# EAGLE design LED (EAGLE 7.6.0)
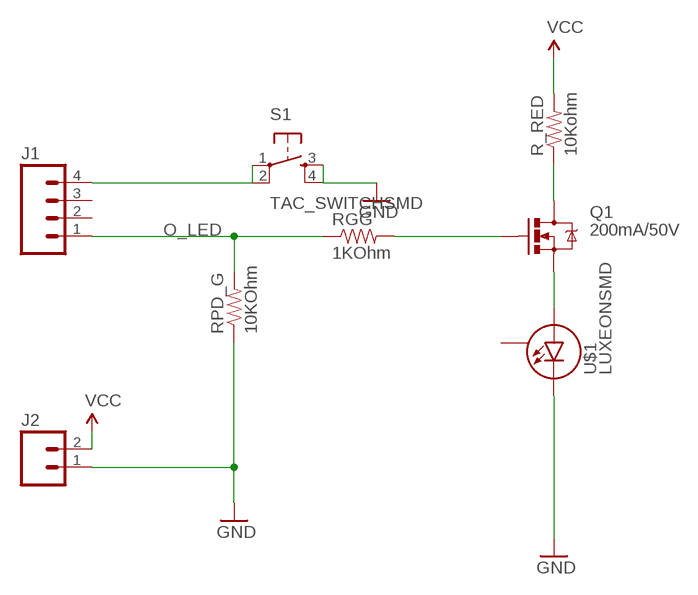
[diagram p0: schematic, sheet 1]

## Parts
J1  M04NO_SILK_ALL_ROUND  [1X04_NO_SILK_ALL_ROUND]
J2  M021X02_NO_SILK  [1X02_NO_SILK]
Q1  200mA/50V  MOSFET-NCHANNELBSS138  [SOT23-3]
R_RED  10Kohm  RESISTOR0805-RES  [0805]
RGG  1KOhm  RESISTOR0805-RES  [0805]
RPD_G  10KOhm  RESISTOR0805-RES  [0805]
S1  TAC_SWITCHSMD  [TACTILE-SWITCH-SMD]
U$1  LUXEONSMD  [LUXEON]

## Nets
GND: J2.1 S1.3 S1.4 U$1.C
N$1: Q1.1(G) RGG.2
N$2 [SUPPLY]: Q1.3(D) R_RED.1
N$3 [SUPPLY]: Q1.2(S) U$1.A
N$4: J1.4 S1.1 S1.2
O_LED: J1.1 RGG.1 RPD_G.2
VCC [SUPPLY]: J2.2 R_RED.2
Unconnected: J1.2 J1.3 RPD_G.1 U$1.S

## Library data of the parts
J1 = SparkFun-Connectors:M04: Header 4 Standard 4-pin 0.1" header. Use with straight break away headers (SKU : PRT-00116), right angle break away headers (PRT-00553), swiss pins (PRT-00743), machine pins (PRT-00117), and female headers (PRT-00115). Molex polarized connector foot print use with SKU : PRT-08231 with associated crimp pins and housings. 1MM SMD Version SKU: PRT-10208; PROD_ID: CONN-09696
J2 = SparkFun-Connectors:M02: Standard 2-pin 0.1" header. Use with - straight break away headers ( PRT-00116) - right angle break away headers (PRT-00553) - swiss pins (PRT-00743) - machine pins (PRT-00117) - female headers (PRT-00115) Molex polarized connector foot print use with: PRT-08233 with associated crimp pins and housings. 2.54_SCREWTERM for use with PRT-10571. 3.5mm Screw Terminal footprints for PRT-08084 5mm Screw Terminal footprints for use with PRT-08432
Q1 = SparkFun-DiscreteSemi:MOSFET-NCHANNEL: Common NMOSFET Parts MFG P/N Store ID Prod ID FDD8780 TRANS-09984 SI7820DN TRANS-11055 FDS6630A IC-08089 2N7002PW TRANS-11151 FQP30N06L COM-10213 TRANS-10060 BSS123LT1G TRANS-08345 BSS138 TRANS-00830 BS170 2N7000; PROD_ID: TRANS-00830
R_RED RGG RPD_G = SparkFun-Resistors:RESISTOR: Resistor Basic schematic elements and footprints for 0603, 1206, and PTH resistors.
S1 = SparkFun-Retired:TAC_SWITCH: Momentary Switch Button commonly used for reset or general input. Spark Fun Electronics SKU : COM-00097 SMT- SWCH-08247; PROD_ID: SWCH-08247
U$1 = SparkFun-LED:LUXEON: Luxeon LED This footprint works with the current 1 Watt, 3 Watt, and 5 Watt LEDs. These blindingly bright LEDs generate a lot of heat so the footprint has a large pad under the LED for thermal transfer. Schematic and footprint are proven. Spark Fun Electronics SKU : COM-00603

## Net classes
0 default: width 0.3 mm
1 GND: width 0.5 mm, clearance 0.5 mm
2 SUPPLY: width 0.5 mm, clearance 0.003 mm

## Board
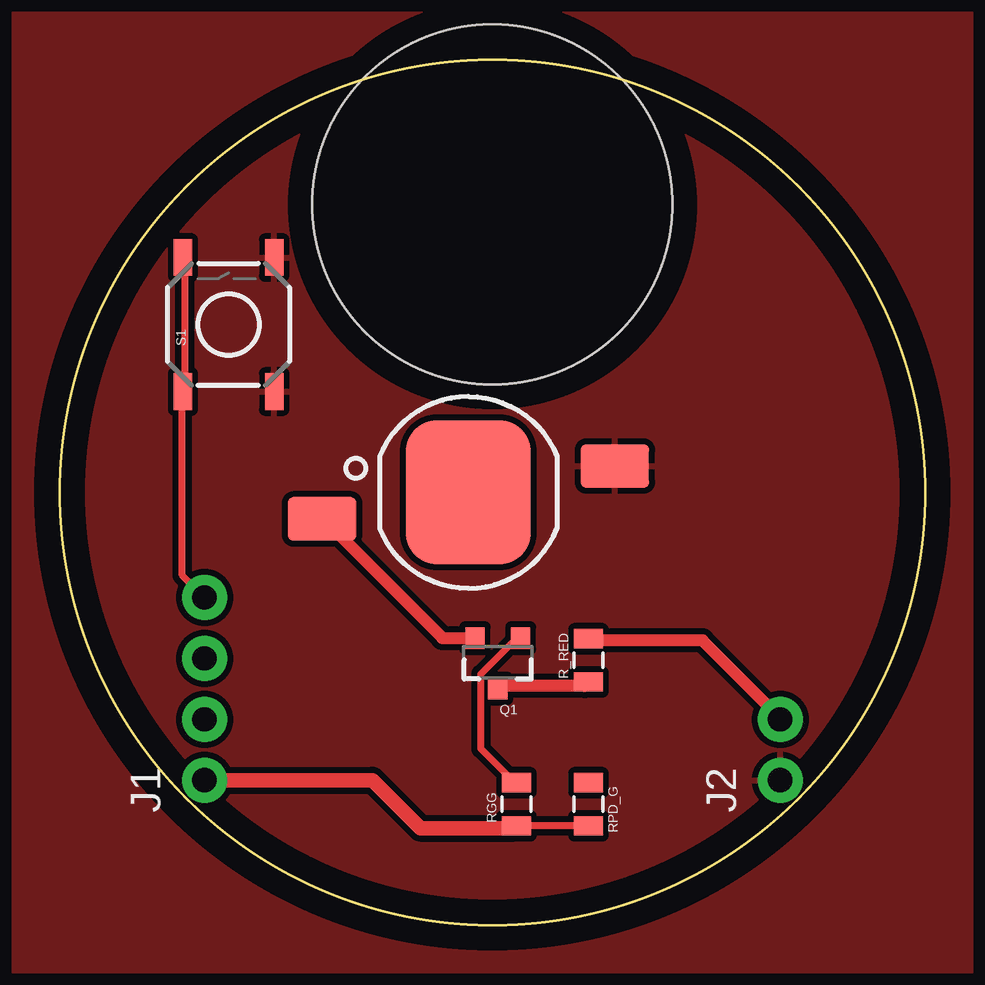
[diagram p1: board, top side]
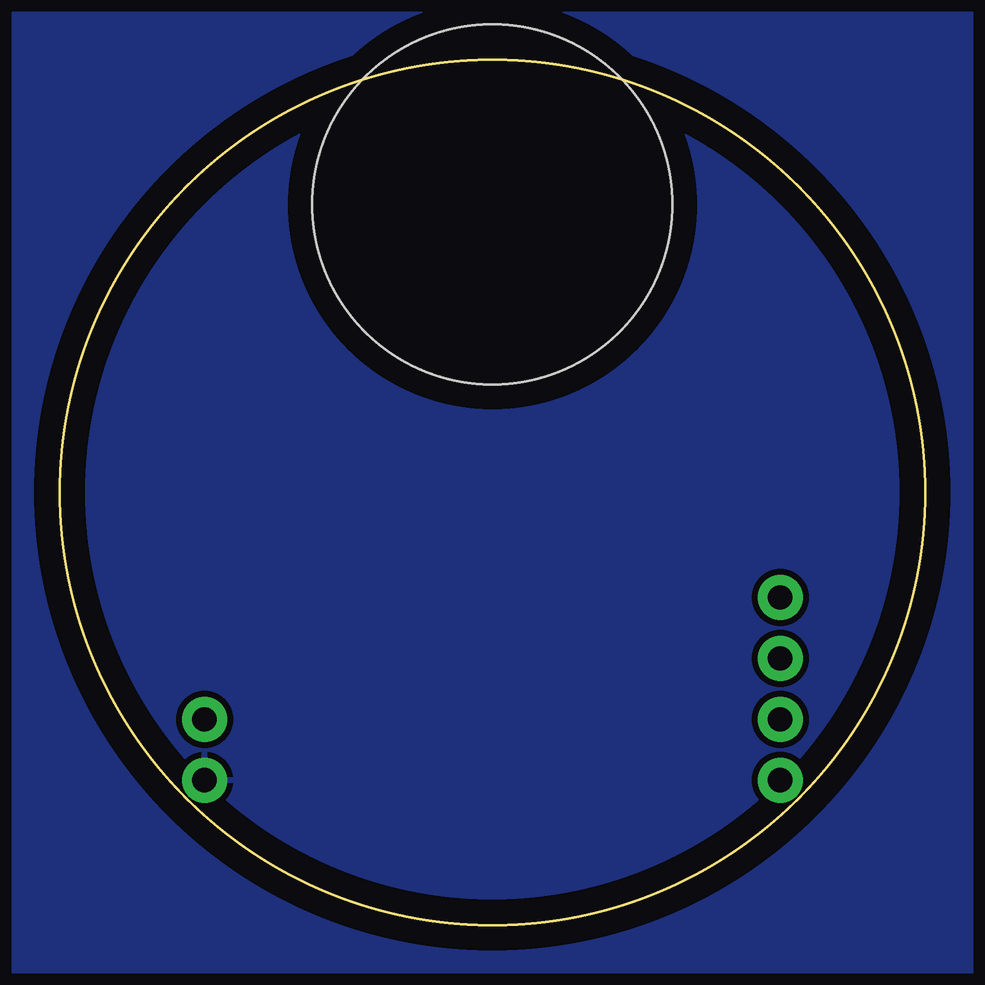
[diagram p2: board, bottom side, seen from below]

Size 36.06 x 36.06 mm. Coordinates in mm from the lower left corner, seen from the top.
Outline: circle at 18.03,18.03 radius 18.03
Copper layers (1*16): Top 0.035mm / dielectric 1.5mm / Bottom 0.035mm
Design rules "baballe": minimum track width 5mil, minimum drill 24mil, track to track 4mil, track to pad 4mil, pad to pad 4mil, via to via 4mil, smd to smd 2mil, copper to edge 40mil, drill to drill 8mil, minimum pad ring 10mil, minimum via ring 8mil, stop-mask expansion 4mil, vias tented up to drill 0mil, thermal gap 10mil
Holes 15 mm at 18.03,30.03

### Footprints (pad centres in the part's own frame; a part is rotated, then mirrored left to right if it is on the bottom)
1X04_NO_SILK_ALL_ROUND = drill 1.016 pad 1.88: 1 0,0; 2 2.54,0; 3 5.08,0; 4 7.62,0
1X02_NO_SILK = drill 1.016 pad 1.88: 1 0,0; 2 2.54,0
SOT23-3 = smd 0.8 x 0.9: 1 -0.95,-1; 2 0.95,-1; 3 0,1.1
0805 = smd 0.8 x 1.2: 1 -0.9,0; 2 0.9,0
TACTILE-SWITCH-SMD = smd 1.524 x 0.762: 1 -2.794,1.905; 2 2.794,1.905; 3 -2.794,-1.905; 4 2.794,-1.905
LUXEON = smd 2.85 x 1.8: A -6.1,-1.1; C 6.1,1.1 | smd 5.2 x 6: S 0,0

### Placement (x,y rotation side)
J1  6.03,6.03 90 top
J2  30.03,6.03 90 top
Q1  18.25,10.95 180 top
R_RED  22.03,11.03 90 top
RGG  19.03,5.03 90 top
RPD_G  22.03,5.03 270 top
S1  7.03,25.03 90 top
U$1  17.03,18.03 0 top

### Tracks (layer width: path | path; a pad name or v marks a point on that pad's centre or on a via)
GND
  pour Top (isolate 0.254): -0.97,38.03 38.03,38.03 38.03,-1.97 -1.97,-1.97 -1.97,38.03
  pour Bottom (isolate 0.254): -0.97,38.03 38.03,38.03 38.03,-1.97 -1.97,-1.97 -1.97,38.03
N$1
  Top 0.3: Q1.1 19.16,11.86 18.95,11.86 17.55,10.45 17.55,7.34 18.95,5.94 RGG.2
N$2
  Top 0.5: Q1.3 18.35,9.95 21.87,9.95 21.97,10.05 R_RED.1
N$3
  Top 0.5: Q1.2 17.25,11.96 15.94,11.96 11.02,16.88 U$1.A
N$4
  Top 0.3: S1.2 5.2,27.72 5.2,22.3 S1.1 5.1,22.1 5.1,14.57 6,13.67 J1.4
O_LED
  Top 0.3: RGG.1 19.05,4.13 21.97,4.13 RPD_G.2
  Top 0.61: J1.1 13.03,6.03 15.03,4.03 18.93,4.03 RGG.1
VCC
  Top 0.5: R_RED.2 22.07,11.86 26.79,11.86 30,8.65 J2.2